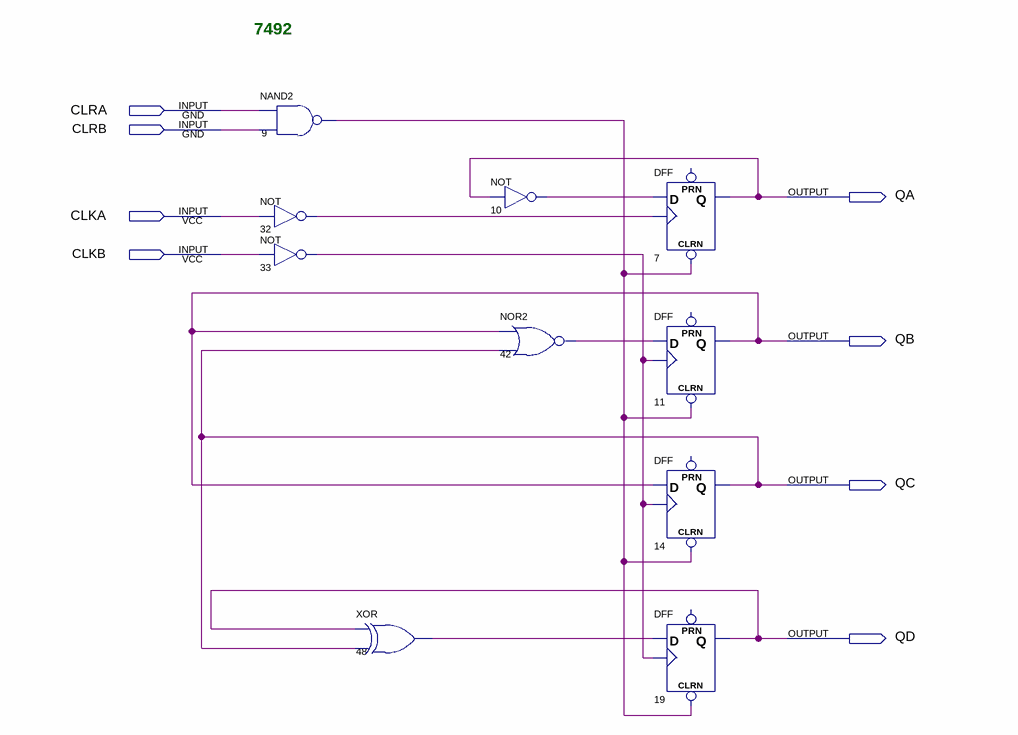
[diagram p0: schematic sheet]
// Quartus schematic 7492.bdf as structural Verilog: 10 symbols, 8 pins
module \7492  (
  input  CLRA,
  input  CLRB,
  input  CLKA,
  input  CLKB,
  output QA,
  output QB,
  output QC,
  output QD
);

  wire n9_out, n10_out, n32_out, n33_out, n42_out, n48_out;

  nand u_9 (n9_out, CLRA, CLRB);
  not u_32 (n32_out, CLKA);
  not u_33 (n33_out, CLKB);
  xor u_48 (n48_out, QD, QC);
  not u_10 (n10_out, QA);
  nor u_42 (n42_out, QB, QC);
  DFF u_7 (.CLRN(n9_out), .CLK(n32_out), .D(n10_out), .Q(QA));  // open: PRN
  DFF u_11 (.CLRN(n9_out), .CLK(n33_out), .D(n42_out), .Q(QB));  // open: PRN
  DFF u_14 (.CLRN(n9_out), .CLK(n33_out), .D(QB), .Q(QC));  // open: PRN
  DFF u_19 (.CLRN(n9_out), .CLK(n33_out), .D(n48_out), .Q(QD));  // open: PRN

  // Notes on the sheet:
  //   7492
endmodule
